# EAGLE design MS20 Filter clone (EAGLE 7.4.0)
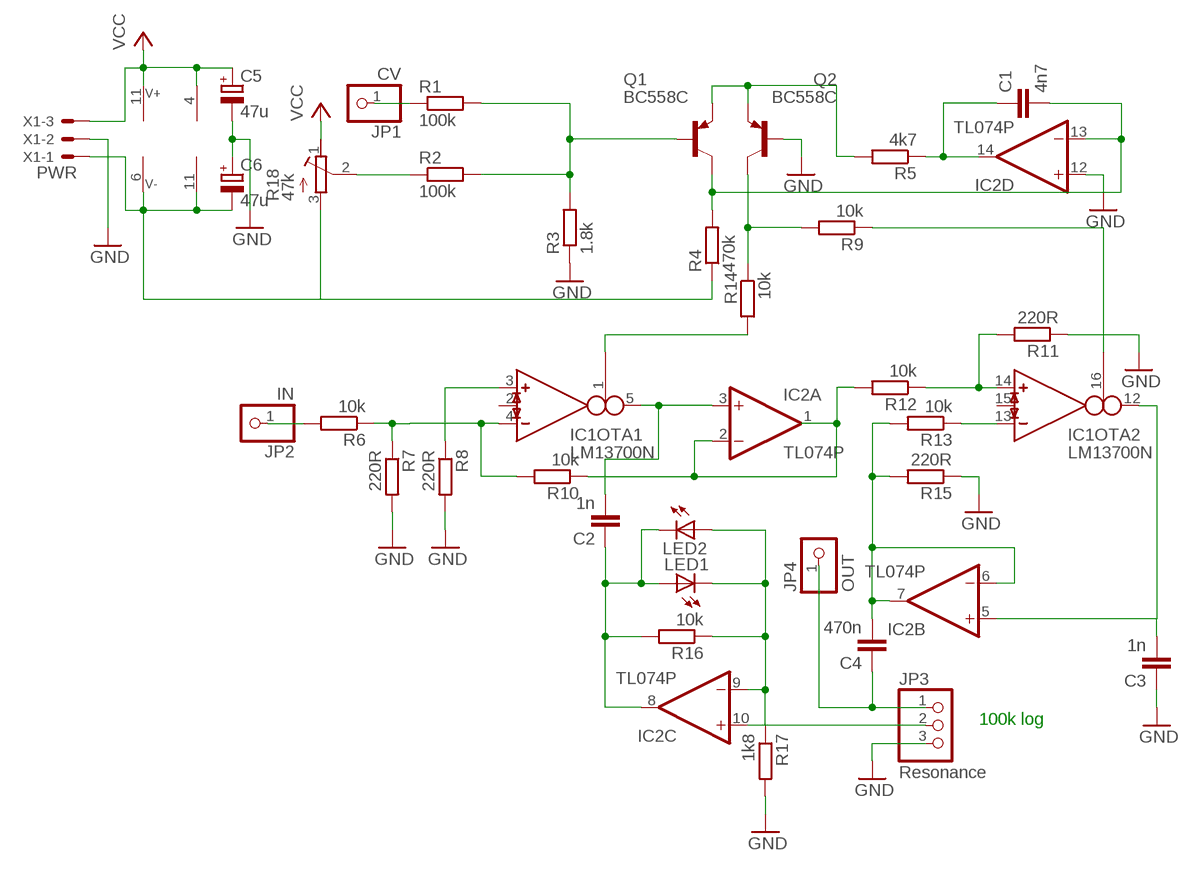
[diagram p0: schematic, sheet 1]

## Parts
C1  4n7  C-EU050-024X044  [C050-024X044]
C2  1n  C-EU050-024X044  [C050-024X044]
C3  1n  C-EU050-024X044  [C050-024X044]
C4  470n  C-EU050-024X044  [C050-024X044]
C5  47u  CPOL-EUE2.5-6  [E2,5-6]
C6  47u  CPOL-EUE2.5-6  [E2,5-6]
IC1  LM13700N  [DIL16]
IC2  TL074P  [DIL14]
JP1  CV  PINHD-1X1  [1X01]
JP2  IN  PINHD-1X1  [1X01]
JP3  Resonance  PINHD-1X3CB  [1X03-CLEANBIG]
JP4  OUT  PINHD-1X1  [1X01]
LED1  LED5MM  [LED5MM]
LED2  LED5MM  [LED5MM]
Q1  BC558C  [TO92-EBC]
Q2  BC558C  [TO92-EBC]
R1  100k  R-EU_0204/5  [0204/5]
R2  100k  R-EU_0204/7  [0204/7]
R3  1.8k  R-EU_0204/7  [0204/7]
R4  470k  R-EU_0204/7  [0204/7]
R5  4k7  R-EU_0204/2V  [0204V]
R6  10k  R-EU_0204/7  [0204/7]
R7  220R  R-EU_0204/7  [0204/7]
R8  220R  R-EU_0204/7  [0204/7]
R9  10k  R-EU_0204/7  [0204/7]
R10  10k  R-EU_0204/5  [0204/5]
R11  220R  R-EU_0204/5  [0204/5]
R12  10k  R-EU_0204/7  [0204/7]
R13  10k  R-EU_0204/5  [0204/5]
R14  10k  R-EU_0204/2V  [0204V]
R15  220R  R-EU_0204/2V  [0204V]
R16  10k  R-EU_0204/2V  [0204V]
R17  1k8  R-EU_0204/2V  [0204V]
R18  47k  R-TRIMMT93YA  [RTRIMT93YA]
X1  PWR  JST-XH-03-PIN-LONG-PAD  [JST-XH-03-PACKAGE-LONG-PAD]

## Nets
GND: C3.1 C5.- C6.+ IC2.12(D:+IN) JP3.3 Q2.B R3.1 R7.2 R8.2 R11.1 R15.1 R17.2 X1.2
N$1: Q1.B R1.2 R2.2 R3.2
N$2: R2.1 R18.2(S)
N$3: C1.2 IC2.13(D:-IN) Q1.C R4.2
N$4: JP1.1 R1.1
N$5: Q1.E Q2.E R5.2
N$6: IC2.9(C:-IN) LED1.K(C) LED2.A R16.1 R17.1
N$7: C1.1 IC2.14(D:OUT) R5.1
N$8: Q2.C R9.2 R14.1
N$9: IC1.1(OTA1:I_BIAS) R14.2
N$10: JP2.1 R6.2
N$11: IC1.16(OTA2:I_BIAS) R9.1
N$12: IC1.4(OTA1:IN_N) R6.1 R7.1 R10.2
N$13: IC1.3(OTA1:IN_P) R8.1
N$15: C2.2 IC1.5(OTA1:OUT) IC2.3(A:+IN)
N$16: IC2.2(A:-IN) R10.1 R12.2
N$17: IC1.14(OTA2:IN_P) R11.2 R12.1
N$18: C4.2 IC2.6(B:-IN) IC2.7(B:OUT) R13.2 R15.2
N$19: IC1.13(OTA2:IN_N) R13.1
N$20: C3.2 IC1.12(OTA2:OUT) IC2.5(B:+IN)
N$21: IC2.10(C:+IN) JP3.2
N$22: C2.1 IC2.8(C:OUT) LED1.A LED2.K(C) R16.2
N$23: C4.1 JP3.1 JP4.1
V-: C6.- IC1.6(SUPPLY:V-) IC2.11(P:V-) R4.1 R18.3(A) X1.1
VCC: C5.+ IC1.11(SUPPLY:V+) IC2.4(P:V+) R18.1(E) X1.3
Unconnected: IC1.2(OTA1:I_DIODE) IC1.7(BUF1:B) IC1.8(BUF1:E) IC1.9(BUF2:E) IC1.10(BUF2:B) IC1.15(OTA2:I_DIODE) IC2.1(A:OUT)

## Notes on the sheet
- 100k log

## Library data of the parts
C1-C4 = rcl:C-EU: CAPACITOR, European symbol
C5 C6 = rcl:CPOL-EU: POLARIZED CAPACITOR, European symbol
IC1 = ota:LM13700: Dual OTA with buffers
IC2 = linear:TL074: OP AMP
JP1 JP2 JP4 = adafruit:PINHD-1X1: Pin header 1x1 for 0.1" spacing With round pins
JP3 = adafruit:PINHD-1X3: PIN HEADER
LED1 LED2 = adafruit:LED: LED OSRAM: - CHIPLED LG R971, LG N971, LY N971, LG Q971, LY Q971, LO R971, LY R971 LH N974, LH R974 LS Q976, LO Q976, LY Q976 LO Q996 - Hyper CHIPLED LW Q18S LB Q993, LB Q99A, LB R99A - SideLED LS A670, LO A670, LY A670, LG A670, LP A670 LB A673, LV A673, LT A673, LW A673 LH A674 LY A675 LS A676, LA A676, LO A676, LY A676, LW A676 LS A679, LY A679, LG A679 - Hyper Micro SIDELED® LS Y876, LA Y876, LO Y876, LY Y876 LT Y87S - SmartLED LW L88C, LW L88S LB L89C, LB L89S, LG L890 LS L89K, LO L89K, LY L89K LS L896, LA L896, LO L896, LY L896 - TOPLED LS T670, LO T670, LY T670, LG T670, LP T670 LSG T670, LSP T670, LSY T670, LOP T670, LYG T670 LG T671, LOG T671, LSG T671 LB T673, LV T673, LT T673, LW T673 LH T674 LS T676, LA T676, LO T676, LY T676, LB T676, LH T676, LSB T676, LW T676 LB T67C, LV T67C, LT T67C, LS T67K, LO T67K, LY T67K, LW E67C LS E67B, LA E67B, LO E67B, LY E67B, LB E67C, LV E67C, LT E67C LW T67C LS T679, LY T679, LG T679 LS T770, LO T770, LY T770, LG T770, LP T770 LB T773, LV T773, LT T773, LW T773 LH T774 LS E675, LA E675, LY E675, LS T675 LS T776, LA T776, LO T776, LY T776, LB T776 LHGB T686 LT T68C, LB T68C - Hyper Mini TOPLED® LB M676 - Mini TOPLED Santana® LG M470 LS M47K, LO M47K, LY M47K Source: http://www.osram.convergy.de/
Q1 Q2 = transistor-pnp:BC558*: PNP Transistror
R1-R17 = rcl:R-EU_: RESISTOR, European symbol
R18 = rcl:R-TRIMM: Trimm resistor
X1 = Rembrandt Electronics - JST XH Connectors v1-0:JST-XH-03-PIN: JST XH Connector 2 Pin Wire to board connector. Pitch: 2,54 mm, (0.100") Number of pins: 3 Created by Rembrandt Electronics www.rembrandtelectronics.com

## Board
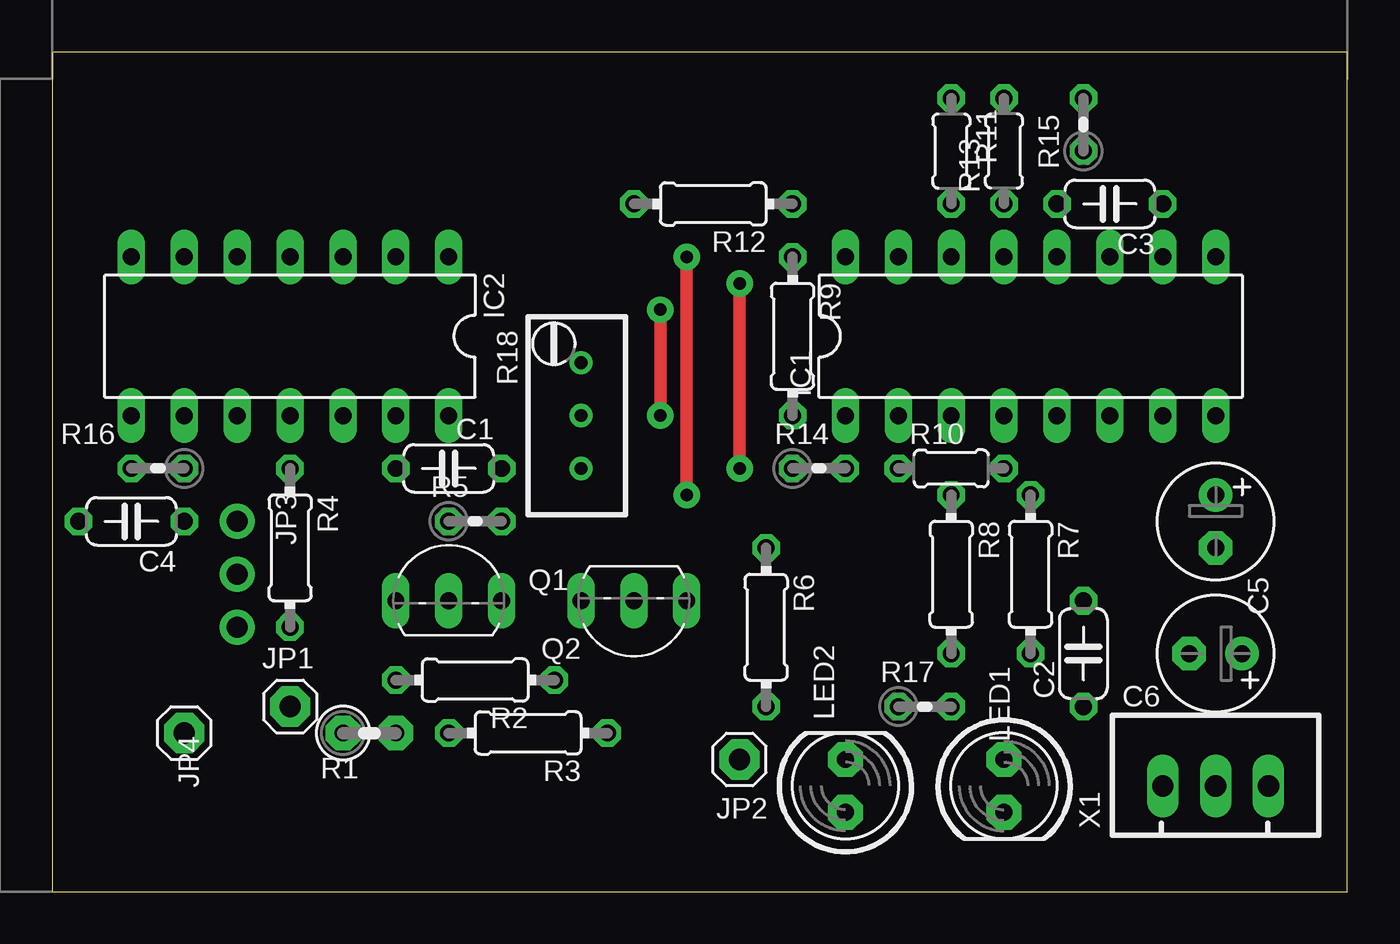
[diagram p1: board, top side]
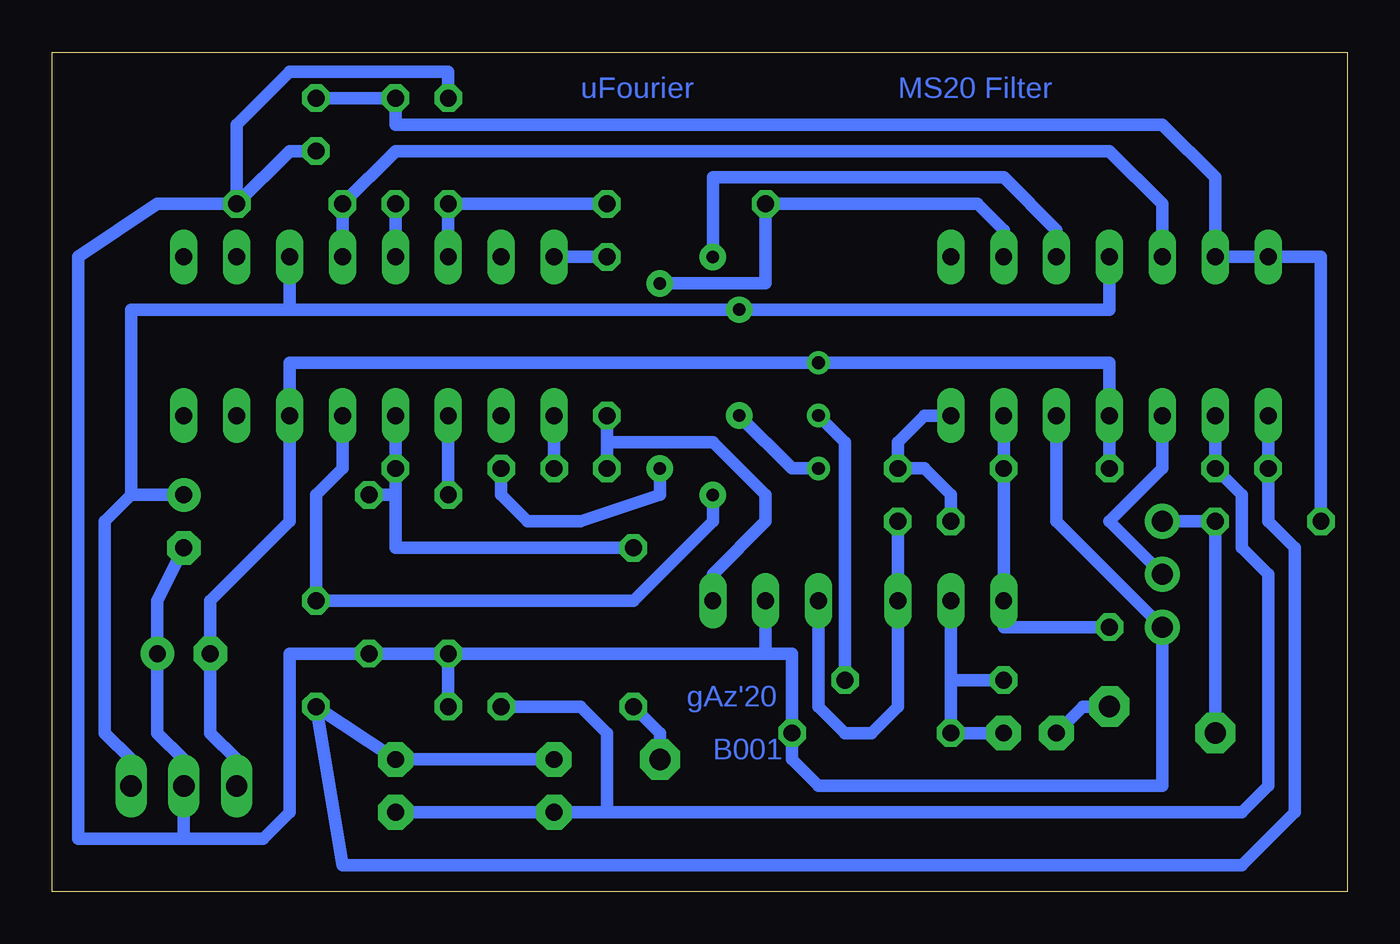
[diagram p2: board, bottom side, seen from below]

Size 62.21 x 40.31 mm. Coordinates in mm from the lower left corner, seen from the top.
Outline: 0,0 62.21,0 62.21,40.31 0,40.31 0,0
Copper layers (1*16): Top 0.035mm / dielectric 1.5mm / Bottom 0.035mm
Design rules "default": minimum track width 10mil, minimum drill 24mil, track to track 8mil, track to pad 8mil, pad to pad 8mil, via to via 8mil, smd to smd 8mil, copper to edge 40mil, drill to drill 8mil, minimum pad ring 10mil, minimum via ring 8mil, stop-mask expansion 4mil, vias tented up to drill 0mil, thermal gap 10mil

### Footprints (pad centres in the part's own frame; a part is rotated, then mirrored left to right if it is on the bottom)
C050-024X044 = drill 0.813 octagon: 1 -2.54,0; 2 2.54,0
E2,5-6 = drill 0.813 pad 1.6: + -1.27,0 | drill 0.813 pad 1.6 octagon: - 1.27,0
DIL16 = drill 0.813 long: 1 -8.89,-3.81; 2 -6.35,-3.81; 3 -3.81,-3.81; 4 -1.27,-3.81; 5 1.27,-3.81; 6 3.81,-3.81; 7 6.35,-3.81; 8 8.89,-3.81; 9 8.89,3.81; 10 6.35,3.81; 11 3.81,3.81; 12 1.27,3.81; 13 -1.27,3.81; 14 -3.81,3.81; 15 -6.35,3.81; 16 -8.89,3.81
DIL14 = drill 0.813 long: 1 -7.62,-3.81; 2 -5.08,-3.81; 3 -2.54,-3.81; 4 0,-3.81; 5 2.54,-3.81; 6 5.08,-3.81; 7 7.62,-3.81; 8 7.62,3.81; 9 5.08,3.81; 10 2.54,3.81; 11 0,3.81; 12 -2.54,3.81; 13 -5.08,3.81; 14 -7.62,3.81
1X01 = drill 1.016 pad 1.93 octagon: 1 0,0
1X03-CLEANBIG = drill 1.016 pad 1.676: 1 -2.54,0; 2 0,0; 3 2.54,0
LED5MM = drill 0.813 pad 1.676 octagon: A -1.27,0; K 1.27,0
TO92-EBC = drill 0.813 long: B 0,-1.27; C -2.54,-1.27; E 2.54,-1.27
0207/2V = drill 0.813 pad 1.676 octagon: 1 -1.27,0; 2 1.27,0
0204/7 = drill 0.813 octagon: 1 -3.81,0; 2 3.81,0
0204V = drill 0.813 octagon: 1 -1.27,0; 2 1.27,0
0204/5 = drill 0.813 octagon: 1 -2.54,0; 2 2.54,0
RTRIMT93YA = drill 0.61: 1 0,-2.54; 2 0,0; 3 0,2.54
JST-XH-03-PACKAGE-LONG-PAD = drill 1.016 long: 1 -2.54,0; 2 0,0; 3 2.54,0

### Placement (x,y rotation side)
C1  19.05,20.32 180 top
C2  49.53,11.43 90 top
C3  50.8,33.02 180 top
C4  3.81,17.78 180 top
C5  [E2,5-6]  55.88,17.78 270 top
C6  [E2,5-6]  55.88,11.43 180 top
IC1  46.99,26.67 0 top
IC2  11.43,26.67 180 top
JP1  11.43,8.89 0 top
JP2  33.02,6.35 180 top
JP3  8.89,15.24 270 top
JP4  6.35,7.62 90 top
LED1  45.72,5.08 270 top
LED2  38.1,5.08 90 top
Q1  19.05,15.24 0 top
Q2  27.94,12.7 180 top
R1  100k  [0207/2V]  15.24,7.62 0 top
R2  20.32,10.16 180 top
R3  22.86,7.62 180 top
R4  11.43,16.51 270 top
R5  20.32,17.78 0 top
R6  34.29,12.7 270 top
R7  46.99,15.24 270 top
R8  43.18,15.24 270 top
R9  35.56,26.67 270 top
R10  43.18,20.32 0 top
R11  43.18,35.56 270 top
R12  31.75,33.02 180 top
R13  45.72,35.56 90 top
R14  36.83,20.32 0 top
R15  49.53,36.83 90 top
R16  5.08,20.32 180 top
R17  41.91,8.89 0 top
R18  25.4,22.86 0 top
X1  55.88,5.08 0 top

### Tracks (layer width: path | path; a pad name or v marks a point on that pad's centre or on a via)
GND
  Bottom 0.61: R17.2 R8.2 | IC2.12 13.97,17.78 JP3.3 8.89,5.08 25.4,5.08 26.67,6.35 R3.1 26.67,11.43 27.94,11.43 | 27.94,11.43 R8.2 | R11.1 43.18,39.37 50.8,39.37 53.34,36.83 C3.1 | C5.- 57.15,13.97 C6.+ 57.15,7.62 55.88,6.35 X1.2 55.88,2.54 | R8.2 R7.2 50.8,11.43 50.8,3.81 52.07,2.54 55.88,2.54 | C3.1 57.15,33.02 60.96,30.48 60.96,2.54 55.88,2.54 | R15.1 50.8,35.56 C3.1 | Q2.B 27.94,11.43
N$1
  Bottom 0.61: R2.2 19.05,10.16 R3.2 | R3.2 Q1.B | R3.2 R1.2
N$2
  Bottom 0.61: R18.2 24.13,21.59 R2.1
N$3
  Bottom 0.61: IC2.13 C1.2 Q1.C 16.51,12.7 R4.2
N$4
  Bottom 0.61: R1.1 12.7,8.89 JP1.1
N$5
  Bottom 0.61: R5.2 Q1.E 21.59,8.89 22.86,7.62 24.13,7.62 25.4,8.89 Q2.E
N$6
  Bottom 0.61: LED1.K LED2.A 35.56,3.81 | R17.1 38.1,8.89 36.83,8.89 35.56,7.62 35.56,3.81 | IC2.9 R16.1 5.08,19.05 5.08,16.51 3.81,15.24 3.81,5.08 5.08,3.81 35.56,3.81
N$7
  Bottom 0.61: IC2.14 20.32,22.86 21.59,21.59 C1.1 20.32,20.32 19.05,19.05 R5.1
N$8
  Bottom 0.61: R9.2 35.56,21.59 | 35.56,21.59 R14.1 | Q2.C 30.48,15.24 27.94,17.78 27.94,19.05 30.48,21.59 35.56,21.59
N$9
  Bottom 0.61: R14.2 IC1.1
N$10
  Bottom 0.61: R6.2 33.02,7.62 JP2.1
N$11
  Bottom 0.61: R9.1 IC1.16
N$12
  Bottom 0.61: IC1.4 R10.2 45.72,19.05 | R6.1 45.72,16.51 45.72,19.05 | 45.72,19.05 R7.1
N$13
  Bottom 0.61: R8.1 IC1.3
N$15  (via drill 0.6 pad 1.27)
  Top 0.61: v30.48,30.48 v30.48,19.05
  Bottom 0.61: IC1.5 48.26,20.32 49.53,19.05 C2.2 34.29,13.97 30.48,17.78 v30.48,19.05 | IC2.3 13.97,31.75 16.51,34.29 30.48,34.29 v30.48,30.48
N$16  (via drill 0.6 pad 1.27)
  Top 0.61: v33.02,29.21 v33.02,20.32
  Bottom 0.61: IC2.2 16.51,31.75 17.78,33.02 R12.2 27.94,29.21 v33.02,29.21 | v33.02,20.32 33.02,19.05 36.83,17.78 39.37,17.78 40.64,19.05 R10.1
N$17
  Bottom 0.61: IC1.14 R11.2 R12.1
N$18
  Bottom 0.61: R15.2 R13.2 45.72,36.83 8.89,36.83 6.35,34.29 IC2.6 IC2.7 1.27,30.48 C4.2
N$19
  Bottom 0.61: R13.1 IC1.13
N$20
  Bottom 0.61: IC1.12 C3.2 45.72,35.56 11.43,35.56 8.89,33.02 IC2.5
N$21
  Bottom 0.61: IC2.10 8.89,20.32 11.43,17.78 JP3.2
N$22
  Bottom 0.61: LED2.K LED1.A C2.1 48.26,1.27 5.08,1.27 2.54,3.81 2.54,16.51 3.81,17.78 R16.2 IC2.8
N$23
  Bottom 0.61: JP3.1 C4.1 JP4.1
V-
  Bottom 0.61: R4.1 IC2.11 11.43,25.4 R18.3 50.8,25.4 IC1.6 50.8,17.78 54.61,13.97 C6.- 54.61,7.62 53.34,6.35 X1.1
VCC  (via drill 0.6 pad 1.27)
  Top 0.61: v29.21,22.86 v29.21,27.94
  Bottom 0.61: X1.3 58.42,6.35 59.69,7.62 59.69,17.78 58.42,19.05 | IC2.4 11.43,27.94 v29.21,27.94 50.8,27.94 | 50.8,27.94 IC1.11 | 50.8,27.94 58.42,27.94 58.42,19.05 | 58.42,19.05 C5.+ | R18.1 26.67,20.32 v29.21,22.86

### Text on the board
Bottom: MS20 Filter | uFourier | gAz'20 | B001